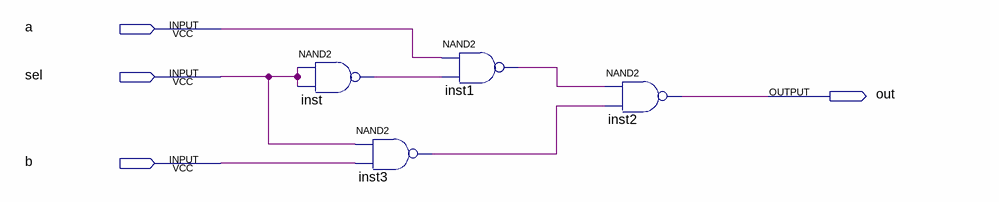
[diagram p0: schematic sheet]
// Quartus schematic Mux.bdf as structural Verilog: 4 symbols, 4 pins
module Mux (
  input  a,
  input  sel,
  input  b,
  output out
);

  wire inst1_out, inst3_out, inst_out;

  nand inst (inst_out, sel, sel);
  nand inst3 (inst3_out, sel, b);
  nand inst1 (inst1_out, a, inst_out);
  nand inst2 (out, inst1_out, inst3_out);
endmodule
